# EAGLE design water_heater (EAGLE 8.1.0)
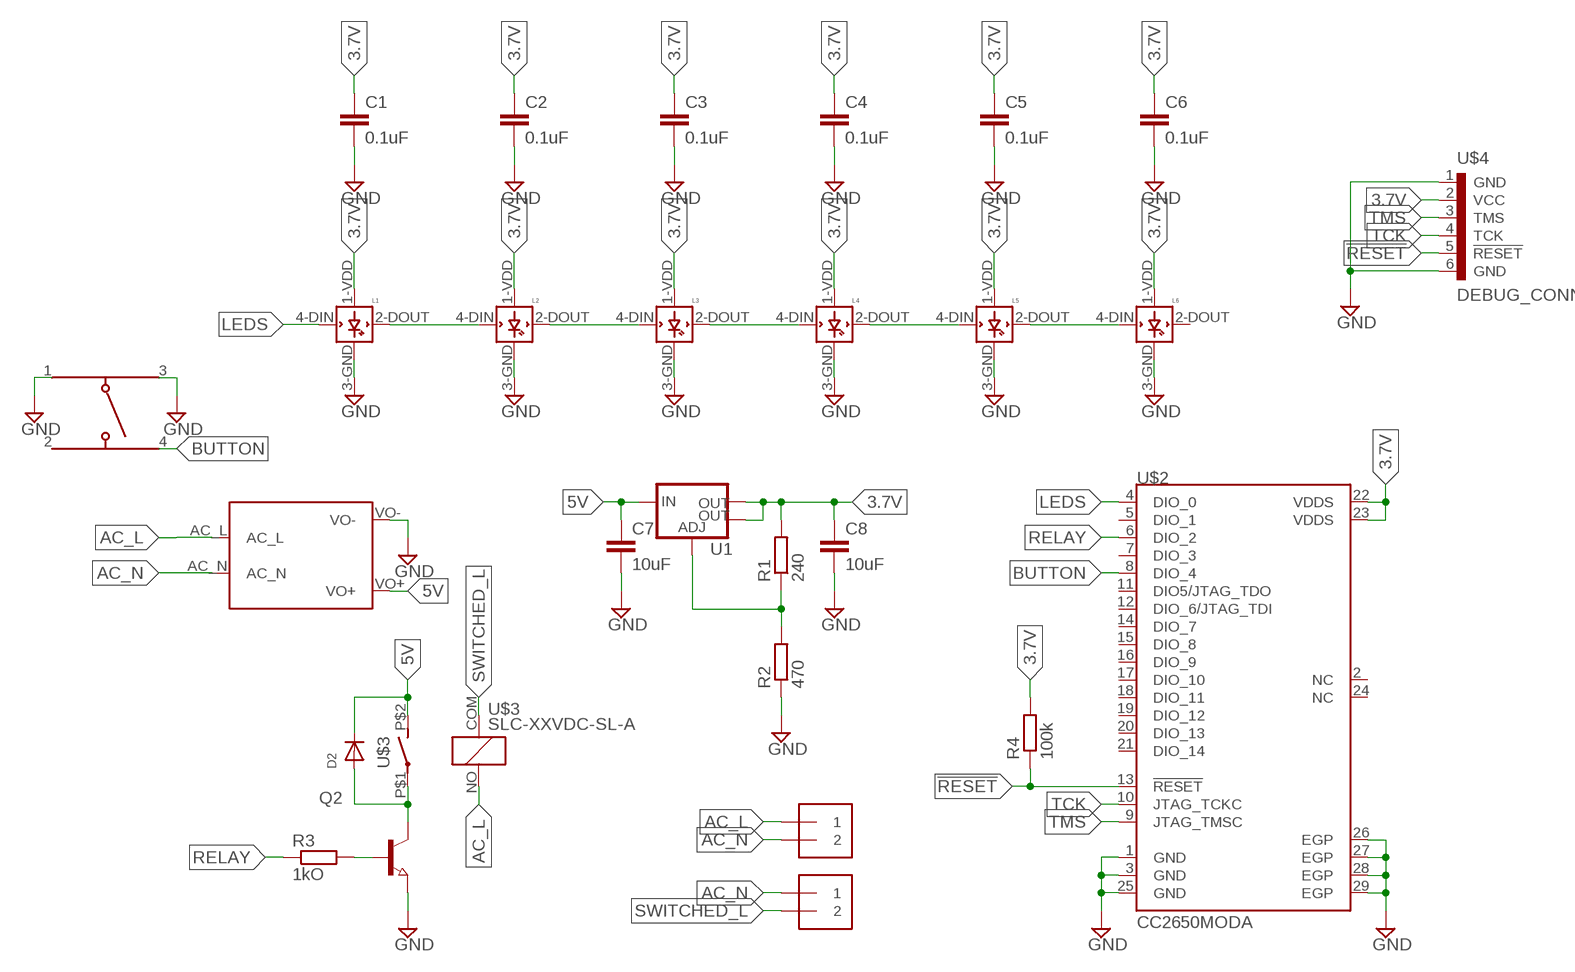
[diagram p0: schematic, sheet 1]

## Parts
C1  0.1uF  CAPACITOR_0402  [0402]
C2  0.1uF  CAPACITOR_0402  [0402]
C3  0.1uF  CAPACITOR_0402  [0402]
C4  0.1uF  CAPACITOR_0402  [0402]
C5  0.1uF  CAPACITOR_0402  [0402]
C6  0.1uF  CAPACITOR_0402  [0402]
C7  10uF  CAPACITOR_0402  [0402]
C8  10uF  CAPACITOR_0402  [0402]
D2  DIODESOD-123  [SOD-123]
L1  WS2812B  [WS2812B]
L2  WS2812B  [WS2812B]
L3  WS2812B  [WS2812B]
L4  WS2812B  [WS2812B]
L5  WS2812B  [WS2812B]
L6  WS2812B  [WS2812B]
Q2  NPN-TRANSISTOR_SOT23  [SOT23]
R1  240  RESISTOR_0402  [0402]
R2  470  RESISTOR_0402  [0402]
R3  1kO  RESISTOR_0402  [0402]
R4  100k  RESISTOR_0402  [0402]
U1  V_REG_LM1117SOT223  [SOT223]
U$1  HLK-PM01  [HLK-PM01]
U$2  CC2650MODA  [CC2650MODA]
U$3  SLC-XXVDC-SL-A  [SLC-1_FORM_A]
U$4  DEBUG_CONN  [DEBUG_CONN]
U$5  CTS222AM  [CTS222AM]
U$8  1X2-5MM-RIGHT  [1X2-5MM-RIGHT]
U$9  1X2-5MM-RIGHT  [1X2-5MM-RIGHT]

## Nets
3.7V: C1.1 C2.1 C3.1 C4.1 C5.1 C6.1 C8.1 L1.1-VDD(VDD) L2.1-VDD(VDD) L3.1-VDD(VDD) L4.1-VDD(VDD) L5.1-VDD(VDD) L6.1-VDD(VDD) R1.2 R4.2 U1.2(OUT) U1.4(OUT) U$2.22(VDDS) U$2.23(VDDS) U$4.2(VCC)
5V: C7.1 D2.C U1.3(IN) U$1.VO+ U$3.P$2(S)
!RESET: R4.1 U$2.13(!RESET) U$4.5(!RESET)
AC_L: U$1.AC_L U$3.NO U$8.1
AC_N: U$1.AC_N U$8.2 U$9.1
BUTTON: U$2.8(DIO_4) U$5.4
GND: C1.2 C2.2 C3.2 C4.2 C5.2 C6.2 C7.2 C8.2 L1.3-GND(GND) L2.3-GND(GND) L3.3-GND(GND) L4.3-GND(GND) L5.3-GND(GND) L6.3-GND(GND) Q2.2(E) R2.1 U$1.VO- U$2.1(GND) U$2.3(GND) U$2.25(GND) U$2.26(EGP) U$2.27(EGP) U$2.28(EGP) U$2.29(EGP) U$4.1(GND) U$4.6(GND) U$5.1 U$5.3
LEDS: L1.4-DIN(DIN) U$2.4(DIO_0)
N$1: Q2.1(B) R3.2
N$4: L4.2-DOUT(DOUT) L5.4-DIN(DIN)
N$5: L1.2-DOUT(DOUT) L2.4-DIN(DIN)
N$7: D2.A Q2.3(C) U$3.P$1(P)
N$8: L2.2-DOUT(DOUT) L3.4-DIN(DIN)
N$9: L3.2-DOUT(DOUT) L4.4-DIN(DIN)
N$11: L5.2-DOUT(DOUT) L6.4-DIN(DIN)
N$13: R1.1 R2.2 U1.1(ADJ)
RELAY: R3.1 U$2.6(DIO_2)
SWITCHED_L: U$3.COM U$9.2
TCK: U$2.10(JTAG_TCKC) U$4.4(TCK)
TMS: U$2.9(JTAG_TMSC) U$4.3(TMS)
Unconnected: L6.2-DOUT(DOUT) U$2.2(NC) U$2.5(DIO_1) U$2.7(DIO_3) U$2.11(DIO5/JTAG_TDO) U$2.12(DIO_6/JTAG_TDI) U$2.14(DIO_7) U$2.15(DIO_8) U$2.16(DIO_9) U$2.17(DIO_10) U$2.18(DIO_11) U$2.19(DIO_12) U$2.20(DIO_13) U$2.21(DIO_14) U$2.24(NC) U$5.2

## Library data of the parts
C1-C8 = mine:CAPACITOR
D2 = adafruit:DIODE: Diode SMADIODE - SMA Surface Mount Package 20V 1A Schottky Diode Digikey: 641-1014-6-ND DO-1N4148 - Through Hole Small Current Diode SOD-123 20V 1 A (.5mV Vf) Schottky Diode - Digikey: MBRX120TPMSCT-ND SOD-323 10V 570mA (.38mV Vf, 3ns) Schottky Diode - Digikey: ZLLS410CT-ND SOD-523 30V 30mA Schottky Diode (RB751S-40TE61) - Digikey: RB751S-40TE61CT-ND SOT23-R/W - SOT23 Package (R = Solder Paste/Reflow Ovens, W = Hand-Soldering) BAT54Film 40V 300mA - Digikey: 497-7162-1-ND
L1-L6 = adafruit:WS2812B
Q2 = semicon-smd-ipc:NPN-TRANSISTOR_: NPN TRANSISTOR
R1-R4 = mine:RESISTOR
U1 = SparkFun-IC-Power:V_REG_LM1117: Voltage Regulator LM1117 Standard adjustable voltage regulator but in SMD form. Spark Fun Electronics SKU : COM-00595; PROD_ID: VREG-08170
U$1 = mine:HLK-PM01
U$2 = mine:CC2650MODA
U$3 = mine:SLC-XXVDC-SL-A
U$4 = mine:DEBUG_CONN
U$5 = mine:CTS222AM
U$8 U$9 = mine:1X2-5MM-RIGHT

## Board
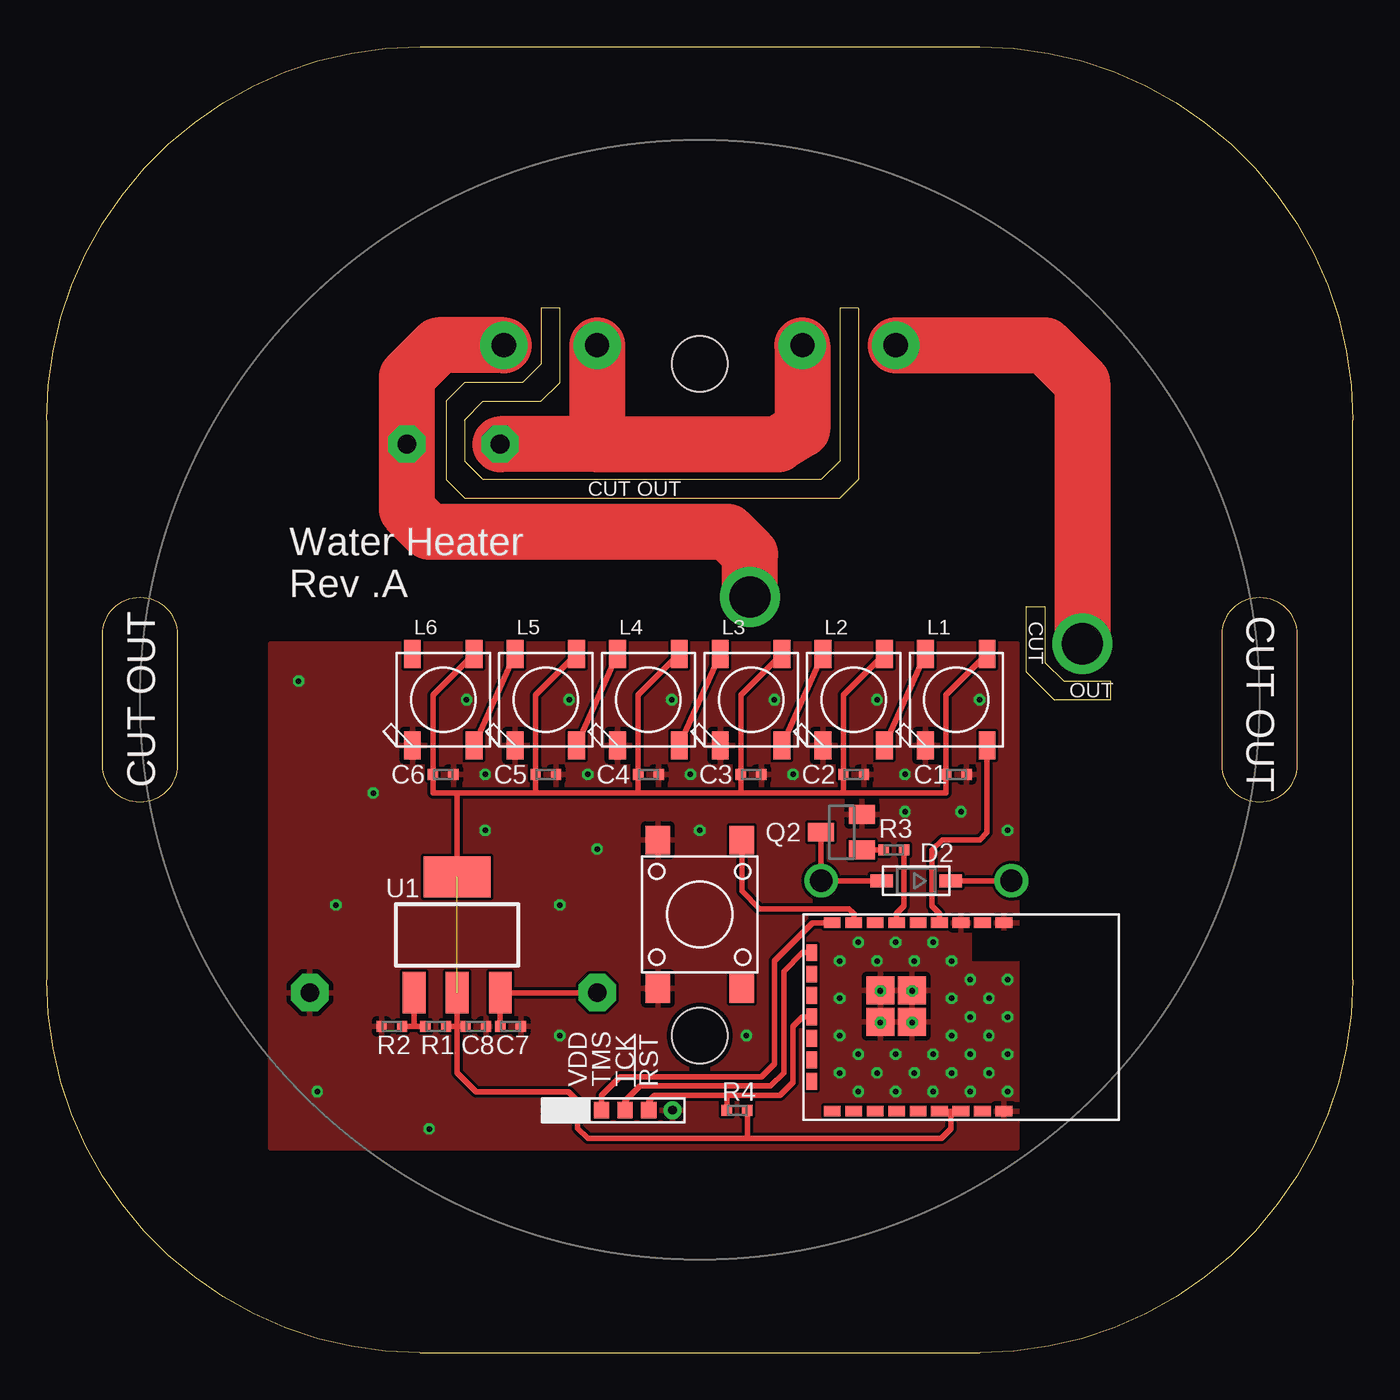
[diagram p1: board, top side]
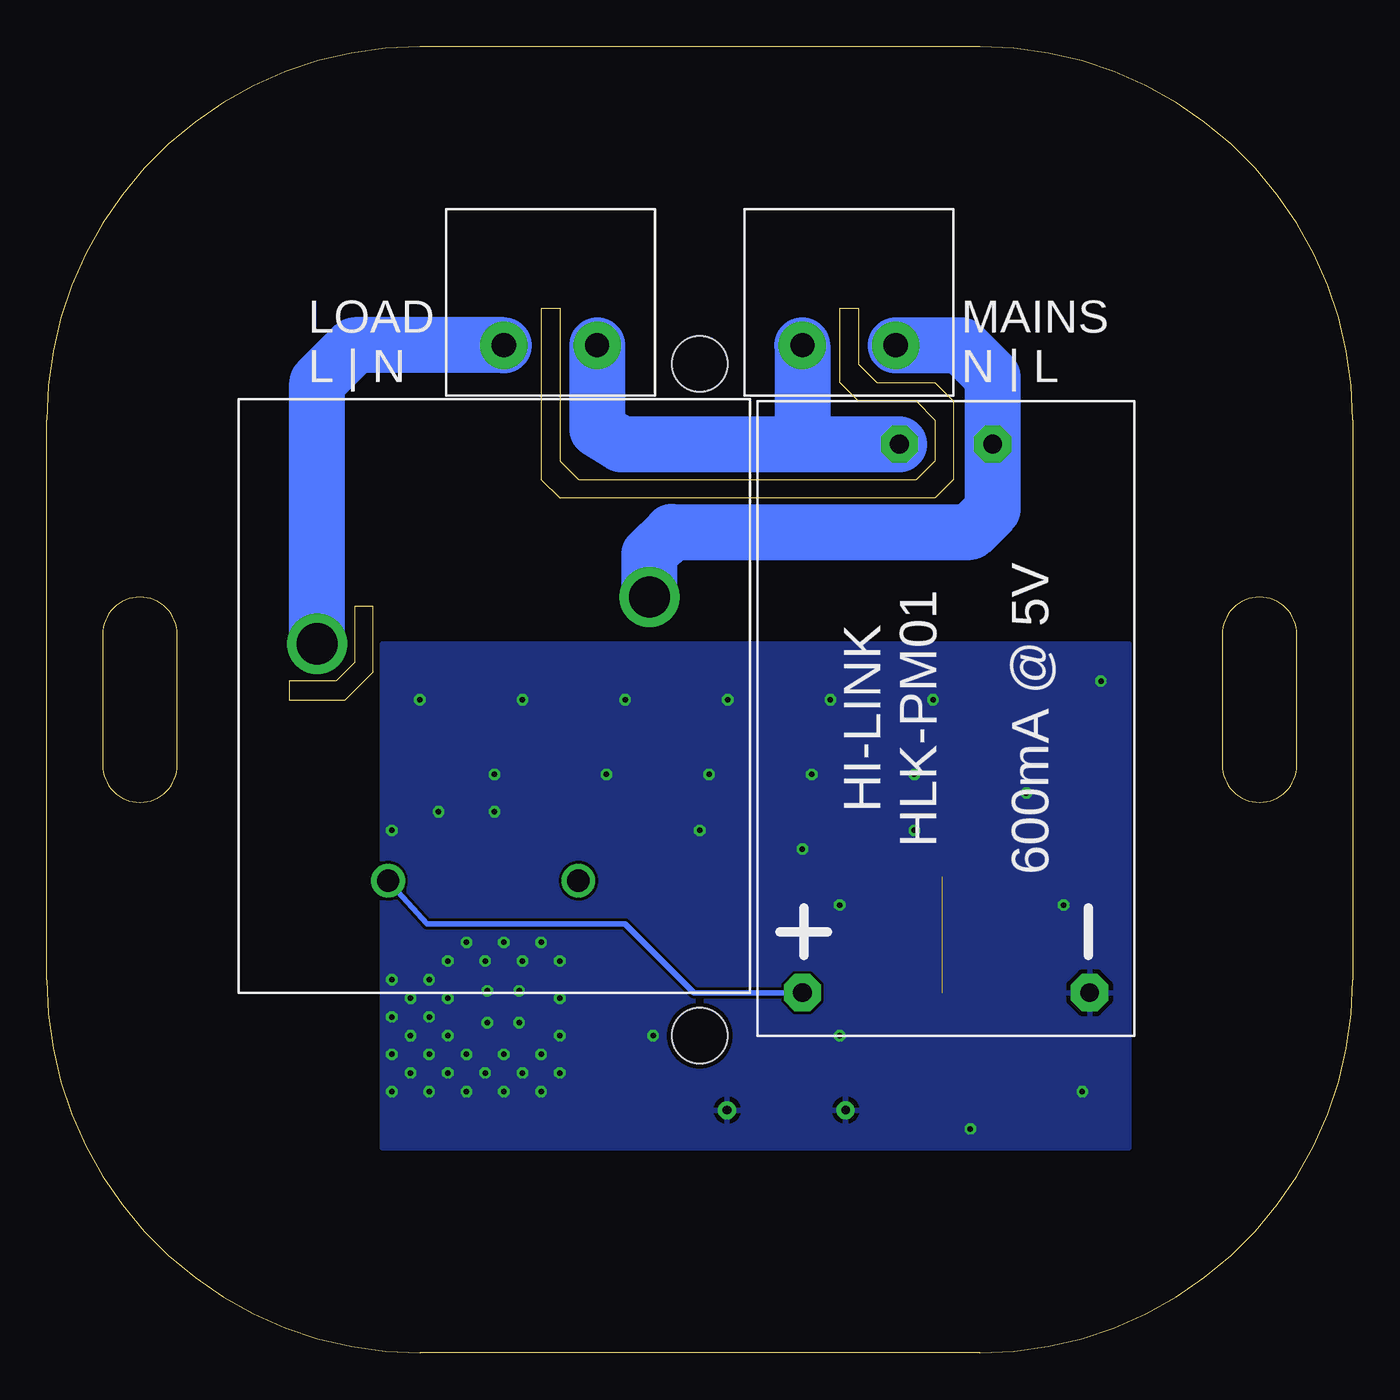
[diagram p2: board, bottom side, seen from below]

Size 70 x 70 mm. Coordinates in mm from the lower left corner, seen from the top.
Outline: 70,20 70,50 arc90 50,70 20,70 arc90 0,50 0,20 arc90 20,0 50,0 arc90 70,20
Outline: 7,38.5 7,31.5 arc-180 3,31.5 3,38.5 arc-180 7,38.5
Outline: 67,38.5 67,31.5 arc-180 63,31.5 63,38.5 arc-180 67,38.5
Outline: 26.5,56 26.5,53 25.5,52 22.4,52 21.4,51 21.4,46.8 22.4,45.8 42.5,45.8 43.5,46.8 43.5,56 42.5,56 42.5,47.8 41.5,46.8 23.4,46.8 22.4,47.8 22.4,50 23.4,51 26.5,51 27.5,52 27.5,56 26.5,56
Outline: 52.5,40 53.5,40 53.5,37 54.5,36 57,36 57,35 54,35 52.5,36.5 52.5,40
Copper layers (1*16): Top 0.035mm / dielectric 1.5mm / Bottom 0.035mm
Design rules "SeeedStudio_2layer_DRU_no_angle_20140221_fixed_drill_size": minimum track width 6mil, minimum drill 0.3mm, track to track 6mil, track to pad 6mil, pad to pad 6mil, via to via 6mil, smd to smd 0mil, copper to edge 10mil, drill to drill 10mil, minimum pad ring 10mil, minimum via ring 6mil, stop-mask expansion 2mil, vias tented up to drill 100mil, thermal gap 10mil
Holes 3 mm at 35,17 35,53

### Footprints (pad centres in the part's own frame; a part is rotated, then mirrored left to right if it is on the bottom)
0402 = smd 0.55 x 0.6: 1 -0.55,0; 2 0.55,0
SOD-123 = smd 1.2 x 0.7: A 1.85,0; C -1.85,0
WS2812B = smd 1.5 x 0.9: 1-VDD 2.45,-1.65; 2-DOUT 2.45,1.65; 3-GND -2.45,1.65; 4-DIN -2.45,-1.65
SOT23 = smd 1 x 1.4: 1 -0.95,-1.1; 2 0.95,-1.1; 3 0,1.1
SOT223 = smd 1.219 x 2.235: 1 -2.311,-3.099; 2 0,-3.099; 3 2.311,-3.099 | smd 3.6 x 2.2: 4 0,3.099
HLK-PM01 = drill 1 pad 2 octagon: AC_L -14.7,2.5; AC_N -14.7,-2.5; VO+ 14.7,-7.7; VO- 14.7,7.7
CC2650MODA = smd 0.55 x 0.9: 1 -5.05,2.3; 2 -5.05,1.15; 3 -5.05,0; 4 -5.05,-1.15; 5 -5.05,-2.3; 6 -5.05,-3.45; 7 -5.05,-4.6; 8 -5.05,-5.75; 9 -5.05,-6.9; 17 5.05,-6.9; 18 5.05,-5.75; 19 5.05,-4.6; 20 5.05,-3.45; 21 5.05,-2.3; 22 5.05,-1.15; 23 5.05,0; 24 5.05,1.15; 25 5.05,2.3 | smd 0.9 x 0.55: 10 -3.45,-8; 11 -2.3,-8; 12 -1.15,-8; 13 0,-8; 14 1.15,-8; 15 2.3,-8; 16 3.45,-8 | smd 1.5 x 1.5: 26 -1.435,-2.625; 27 -1.435,-4.325; 28 0.265,-4.325; 29 0.265,-2.625
SLC-1_FORM_A = drill 2.2: COM 2.8,9.5; NO 5.3,-8.3 | drill 1.2: P$1 -9.9,-4.5; P$2 -9.9,5.7
DEBUG_CONN = drill 0.457: 1 0,3.81; 6 0,-2.54 | smd 0.889 x 0.813: 2 0,2.54; 3 0,1.27; 4 0,0; 5 0,-1.27
CTS222AM = smd 1.55 x 1.3: 1 -3.975,2.25; 2 -3.975,-2.25; 3 3.975,2.25; 4 3.975,-2.25
1X2-5MM-RIGHT = drill 1.3 pad 2.54: 1 2.5,0; 2 -2.5,0

### Placement (x,y rotation side)
C1  48.75,31 0 top
C2  43.25,31 0 top
C3  37.75,31 0 top
C4  32.25,31 0 top
C5  26.75,31 0 top
C6  21.25,31 0 top
C7  24.86,17.5 0 top
C8  23,17.5 0 top
D2  46.6,25.3 180 top
L1  48.75,35 90 top
L2  43.25,35 90 top
L3  37.75,35 90 top
L4  32.25,35 90 top
L5  26.75,35 90 top
L6  21.25,35 90 top
Q2  42.6,27.9 90 top
R1  20.85,17.5 0 top
R2  18.5,17.5 0 top
R3  45.4,26.95 180 top
R4  37,13 0 top
U1  22,22.4 0 top
U$1  21.8,34 270 bottom
U$2  49,18 270 top
U$3  46,35.2 90 bottom
U$4  31,13 90 top
U$5  35,23.5 90 top
U$8  27,54 0 bottom
U$9  43,54 0 bottom

### Tracks (layer width: path | path; a pad name or v marks a point on that pad's centre or on a via)
3.7V  (1 unrouted)
  Top 0.3: 48.45,12.95 U$2.22 | 48.45,12.95 48.45,12 47.95,11.5 37.55,11.5 | U$2.23 48.45,12.95 | R4.2 37.55,11.5 | 37.55,11.5 29,11.5 28.46,12.04 U$4.2 28.46,13.5 27.96,14 23,14 22,15 22,17.5 | 22,30 26.2,30 | 22,30 20.7,30 C6.1 20.7,35.25 L6.1-VDD | 31.7,30 26.2,30 | 37.2,30 31.7,30 | 42.7,30 37.2,30 | 42.7,30 48.2,30 C1.1 48.2,35.25 L1.1-VDD | 26.2,30 C5.1 26.2,35.25 L5.1-VDD | 31.7,30 C4.1 31.7,35.25 L4.1-VDD | 37.2,30 C3.1 37.2,35.25 L3.1-VDD | 42.7,30 C2.1 42.7,35.25 L2.1-VDD | U1.4 22,30 | U1.2 22,17.5 | 22,17.5 R1.2 | 22,17.5 C8.1
5V
  Top 0.3: D2.C U$3.P$2 | U$1.VO+ U1.3 C7.1
  Bottom 0.3: U$1.VO+ 35.3,19.3 39,23 49.6,23 U$3.P$2
!RESET
  Top 0.3: U$4.5 32.27,13.5 32.57,13.8 36.45,13.8 | U$2.13 40.5,18 40,17.5 40,14.5 39.3,13.8 36.45,13.8 | R4.1 36.45,13.8
AC_L
  Top 3: U$3.NO 37.7,42.8 36.5,44 20.5,44 19.3,45.2 U$1.AC_L 19.3,52.3 21,54 U$8.1
  Bottom 3: U$3.NO 37.7,42.8 36.5,44 20.5,44 19.3,45.2 U$1.AC_L 19.3,52.3 21,54 U$8.1
AC_N
  Top 3: 29.5,48.7 U$1.AC_N | 29.5,48.7 39.2,48.7 40.5,49.5 U$9.1 | U$8.2 29.5,48.7
  Bottom 3: 29.5,48.7 U$1.AC_N | 29.5,48.7 39.2,48.7 40.5,49.5 U$9.1 | U$8.2 29.5,48.7
BUTTON
  Top 0.3: U$5.4 37.25,24.75 38.2,23.8 43,23.8 43.25,23.55 U$2.8
GND  (via drill 0.3)
  other vias: 22.5,35 28,35 33.5,35 39,35 44.5,35 50,35 44.68,19.4 46.38,19.4 46.38,17.7 44.68,17.7 51.5,20 51.5,18 51.5,16 51.5,14 50.5,17 50.5,15 50.5,19 49.5,14 49.5,16 49.5,18 49.5,20 48.5,19 48.5,21 48.5,17 48.5,15 46.5,15 44.5,15 42.5,15 47.5,14 45.5,14 43.5,14 43.5,16 45.5,16 47.5,16 42.5,17 42.5,19 42.5,21 44.5,21 46.5,21 47.5,22 45.5,22 43.5,22 13.5,36 17.5,30 15.5,24 14.5,14 20.5,12 27.5,17 27.5,24 23.5,28 35,28 46,29 49,29 51.5,28 29.5,27 37.5,17 23.5,31 29,31 34.5,31 40,31 46,31
  pour Top: 12,11 52,11 52,38 12,38
  pour Bottom: 12,11 52,11 52,38 12,38
LEDS
  Top 0.3: U$2.4 47.85,23.55 47.45,23.95 47.45,26.95 48,27.5 50,27.5 50.4,27.9 L1.4-DIN
N$1
  Top 0.3: Q2.1 R3.2
N$4
  Top 0.3: L5.4-DIN L4.2-DOUT
N$5
  Top 0.3: L1.2-DOUT L2.4-DIN
N$7
  Top 0.3: D2.A U$3.P$1 Q2.3
N$8
  Top 0.3: L2.2-DOUT L3.4-DIN
N$9
  Top 0.3: L3.2-DOUT L4.4-DIN
N$11
  Top 0.3: L6.4-DIN L5.2-DOUT
N$13
  Top 0.3: U1.1 19.69,17.5 | 19.69,17.5 R2.2 | 19.69,17.5 R1.1
RELAY
  Top 0.3: U$2.6 45.55,23.55 45.95,23.95 R3.1
SWITCHED_L
  Top 3: U$3.COM 55.5,52 53.5,54 U$9.2
  Bottom 3: U$3.COM 55.5,52 53.5,54 U$9.2
TCK
  Top 0.3: U$2.10 40.5,21.45 39.5,20.45 39.5,15 38.8,14.3 31.8,14.3 31,13.5 U$4.4
TMS
  Top 0.3: 29.73,13.5 U$4.3 29.73,13.8 30.73,14.8 38.3,14.8 39,15.5 39,21 41.05,23.05 U$2.9

### Text on the board
tPlace: CUT OUT | Water Heater / Rev .A | CUT OUT | CUT | OUT | CUT OUT
bPlace: MAINS / N | L | LOAD / L | N